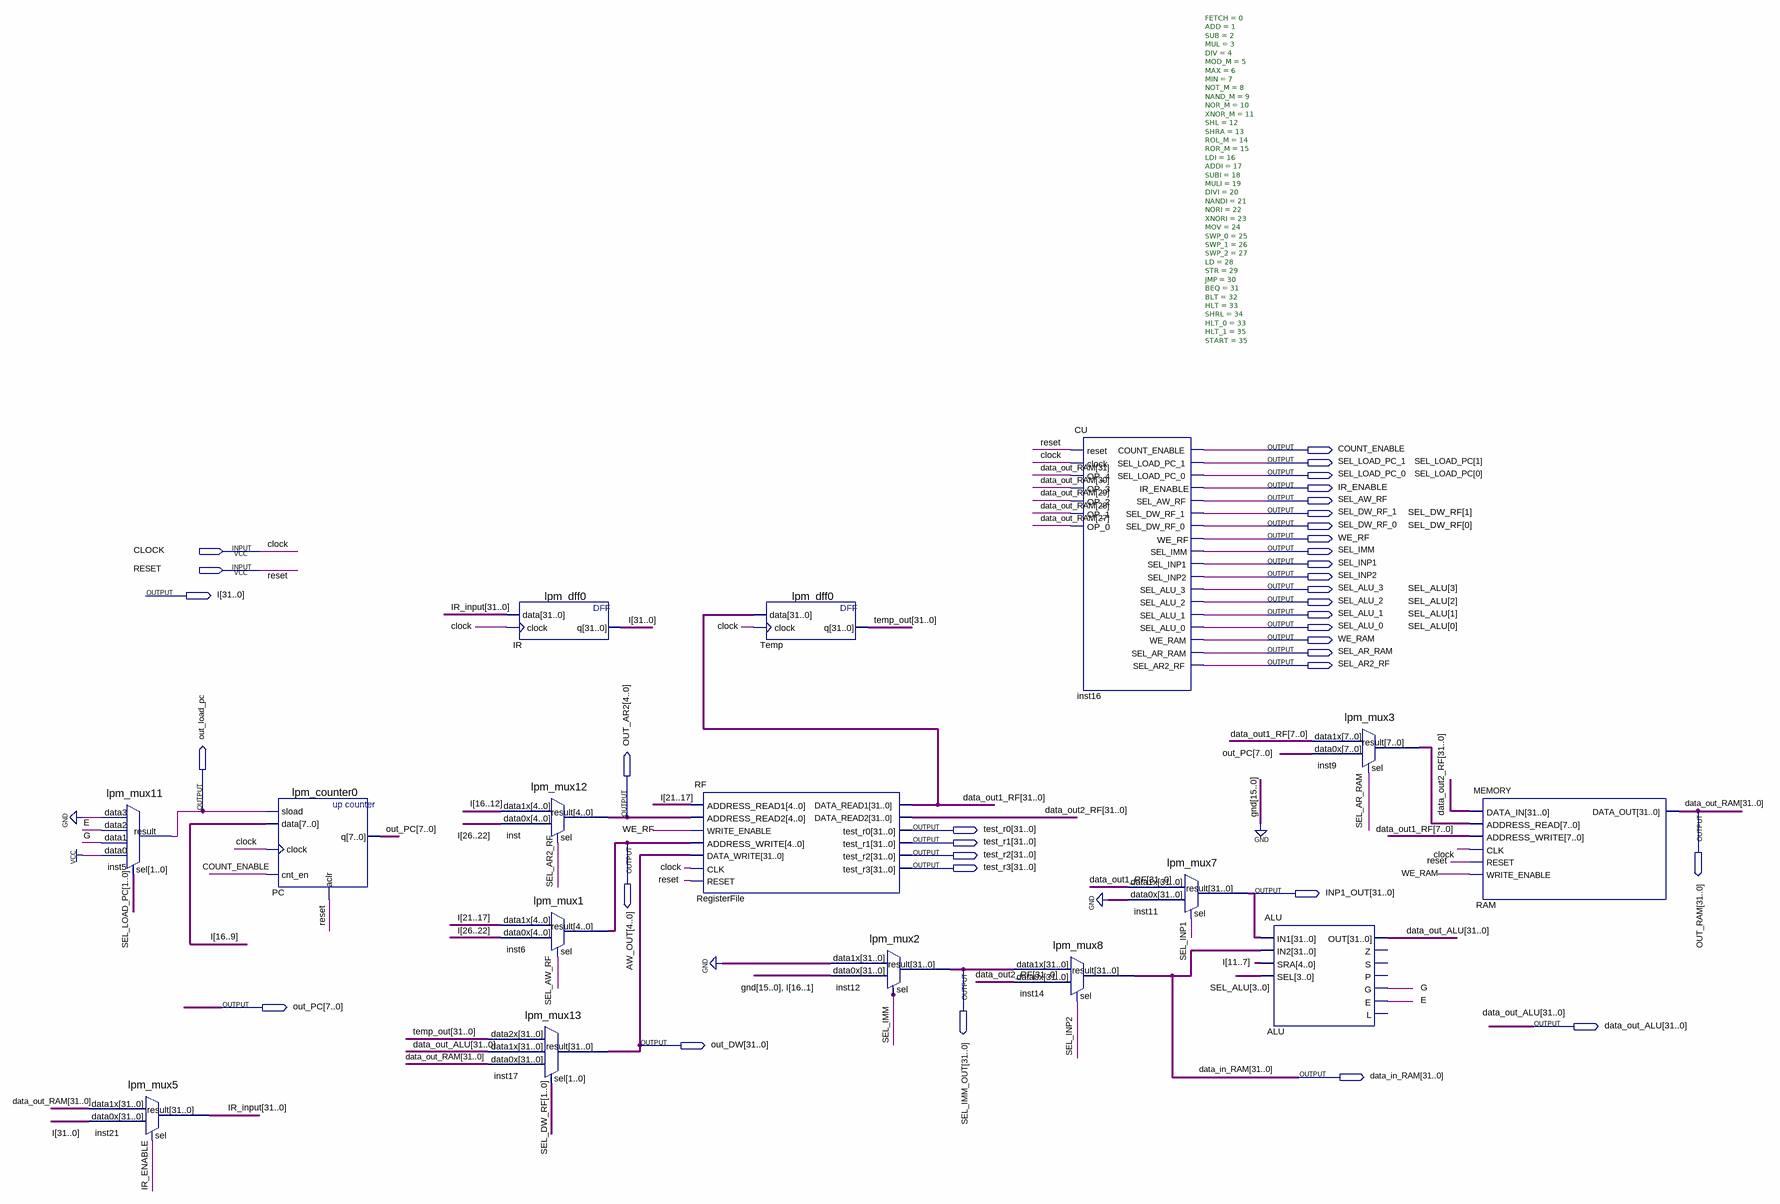
[diagram p0: schematic sheet]
// Quartus schematic CPU.bdf as structural Verilog: 16 symbols, 35 pins
module CPU (
  input  CLOCK,
  input  RESET,
  output COUNT_ENABLE,
  output SEL_LOAD_PC_1,
  output SEL_LOAD_PC_0,
  output IR_ENABLE,
  output SEL_AW_RF,
  output SEL_DW_RF_1,
  output SEL_DW_RF_0,
  output WE_RF,
  output SEL_IMM,
  output SEL_INP1,
  output SEL_INP2,
  output SEL_ALU_3,
  output [31:0] I,
  output SEL_ALU_2,
  output SEL_ALU_1,
  output SEL_ALU_0,
  output WE_RAM,
  output SEL_AR_RAM,
  output SEL_AR2_RF,
  output out_load_pc,
  output [31:0] OUT_RAM,
  output [4:0] OUT_AR2,
  output [31:0] test_r0,
  output [4:0] AW_OUT,
  output [31:0] test_r1,
  output [31:0] test_r2,
  output [31:0] test_r3,
  output [31:0] INP1_OUT,
  output [31:0] SEL_IMM_OUT,
  output [7:0] out_PC,
  output [31:0] data_out_ALU,
  output [31:0] out_DW,
  output [31:0] data_in_RAM
);

  wire E, G;
  wire [7:0] inst9_result;
  wire [31:0] data_out1_RF, data_out2_RF, IR_input, temp_out;

  lpm_mux5 inst21 (.data1x(OUT_RAM), .data0x(I), .sel(IR_ENABLE), .result(IR_input));
  lpm_mux11 inst5 (
    .data3(1'b0), .data2(E), .data1(G), .data0(1'b1), .sel({SEL_LOAD_PC_1, SEL_LOAD_PC_0}),
    .result(out_load_pc));
  lpm_counter0 PC (.sload(out_load_pc), .data(I[16:9]), .clock(CLOCK), .cnt_en(COUNT_ENABLE), .aclr(RESET), .q(out_PC));
  lpm_mux12 inst (.data1x(I[16:12]), .data0x(I[26:22]), .sel(SEL_AR2_RF), .result(OUT_AR2));
  lpm_mux1 inst6 (.data1x(I[21:17]), .data0x(I[26:22]), .sel(SEL_AW_RF), .result(AW_OUT));
  lpm_mux13 inst17 (
    .data2x(temp_out), .data1x(data_out_ALU), .data0x(OUT_RAM), .sel({SEL_DW_RF_1, SEL_DW_RF_0}),
    .result(out_DW));
  lpm_dff0 IR (.data(IR_input), .clock(CLOCK), .q(I));
  RF RegisterFile (
    .ADDRESS_READ1(I[21:17]), .ADDRESS_READ2(OUT_AR2), .WRITE_ENABLE(WE_RF), .ADDRESS_WRITE(AW_OUT),
    .DATA_WRITE(out_DW), .CLK(CLOCK), .RESET(RESET), .DATA_READ1(data_out1_RF), .DATA_READ2(data_out2_RF),
    .test_r0(test_r0), .test_r1(test_r1), .test_r2(test_r2), .test_r3(test_r3));
  lpm_dff0 Temp (.data(data_out1_RF), .clock(CLOCK), .q(temp_out));
  lpm_mux2 inst12 (.data1x({32{1'b0}}), .data0x({{16{1'b0}}, I[16:1]}), .sel(SEL_IMM), .result(SEL_IMM_OUT));
  lpm_mux8 inst14 (.data1x(SEL_IMM_OUT), .data0x(data_out2_RF), .sel(SEL_INP2), .result(data_in_RAM));
  CU #(.FETCH(0), .ADD(1), .SUB(2), .MUL(3), .DIV(4), .MOD_M(5), .MAX(6), .MIN(7), .NOT_M(8), .NAND_M(9), .NOR_M(10), .XNOR_M(11), .SHL(12), .SHRA(13), .ROL_M(14), .ROR_M(15), .LDI(16), .ADDI(17), .SUBI(18), .MULI(19), .DIVI(20), .NANDI(21), .NORI(22), .XNORI(23), .MOV(24), .SWP_0(25), .SWP_1(26), .SWP_2(27), .LD(28), .STR(29), .JMP(30), .BEQ(31), .BLT(32), .HLT(33), .SHRL(34), .HLT_0(33), .HLT_1(35), .START(35)) inst16 (
    .reset(RESET), .clock(CLOCK), .OP_4(OUT_RAM[31]), .OP_3(OUT_RAM[30]), .OP_2(OUT_RAM[29]),
    .OP_1(OUT_RAM[28]), .OP_0(OUT_RAM[27]), .COUNT_ENABLE(COUNT_ENABLE), .SEL_LOAD_PC_1(SEL_LOAD_PC_1),
    .SEL_LOAD_PC_0(SEL_LOAD_PC_0), .IR_ENABLE(IR_ENABLE), .SEL_AW_RF(SEL_AW_RF), .SEL_DW_RF_1(SEL_DW_RF_1),
    .SEL_DW_RF_0(SEL_DW_RF_0), .WE_RF(WE_RF), .SEL_IMM(SEL_IMM), .SEL_INP1(SEL_INP1), .SEL_INP2(SEL_INP2),
    .SEL_ALU_3(SEL_ALU_3), .SEL_ALU_2(SEL_ALU_2), .SEL_ALU_1(SEL_ALU_1), .SEL_ALU_0(SEL_ALU_0),
    .WE_RAM(WE_RAM), .SEL_AR_RAM(SEL_AR_RAM), .SEL_AR2_RF(SEL_AR2_RF));
  lpm_mux7 inst11 (.data1x(data_out1_RF), .data0x({32{1'b0}}), .sel(SEL_INP1), .result(INP1_OUT));
  ALU ALU (
    .IN1(INP1_OUT), .IN2(data_in_RAM), .SRA(I[11:7]), .SEL({SEL_ALU_3, SEL_ALU_2, SEL_ALU_1, SEL_ALU_0}),
    .OUT(data_out_ALU), .G(G), .E(E));  // open: Z, S, P, L
  lpm_mux3 inst9 (.data1x(data_out1_RF[7:0]), .data0x(out_PC), .sel(SEL_AR_RAM), .result(inst9_result));
  MEMORY RAM (
    .DATA_IN(data_out2_RF), .ADDRESS_READ(inst9_result), .ADDRESS_WRITE(data_out1_RF[7:0]), .CLK(CLOCK),
    .RESET(RESET), .WRITE_ENABLE(WE_RAM), .DATA_OUT(OUT_RAM));

  // Other names for the same wires on the sheet: data_out_RAM[31:0] = OUT_RAM;
  //   SEL_ALU[3:0] = {SEL_ALU_3, SEL_ALU_2, SEL_ALU_1, SEL_ALU_0}; SEL_DW_RF[1:0] = {SEL_DW_RF_1, SEL_DW_RF_0};
  //   SEL_LOAD_PC[1:0] = {SEL_LOAD_PC_1, SEL_LOAD_PC_0}
endmodule
